# Altium schematic sheet F_Antenna.SchDoc: F-Antenna
size A4; Address3: Self Checking Shopping Cart; DocumentNumber: 1; Revision: 1.0; SheetNumber: 6; SheetTotal: 7
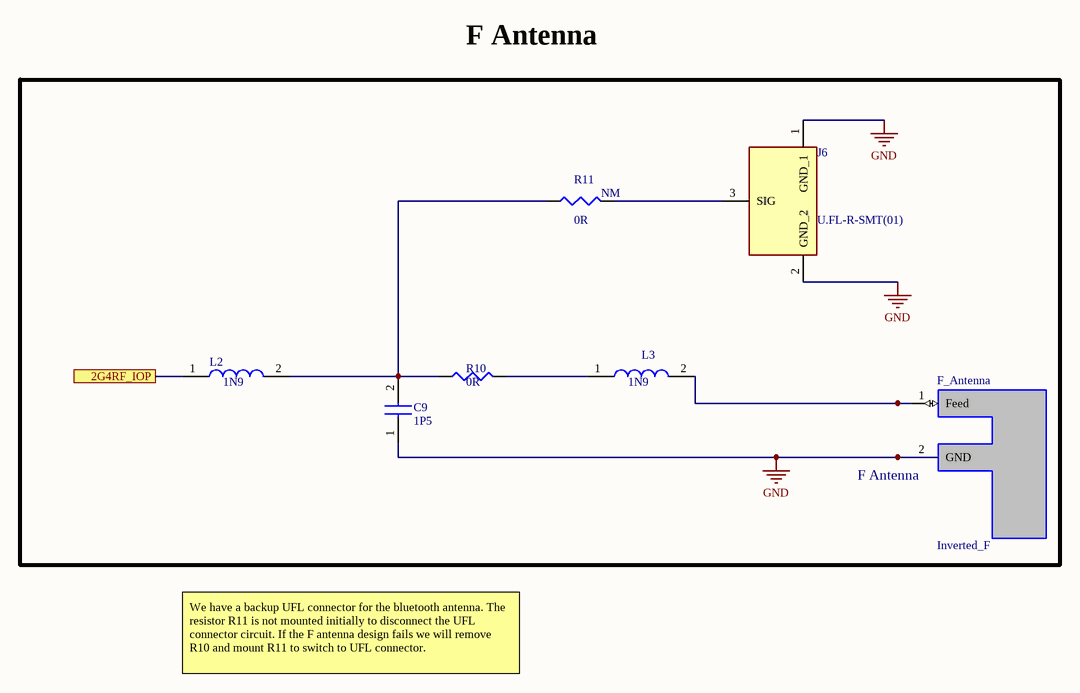
[diagram p0: F_Antenna.SchDoc]

## Parts
C9  value 1P5  [CAPC1005X55N]  (hidden comment: GRM1555C1H1R5WA01D)
F_Antenna  Inverted_F  [Inverted_F]
J6  U.FL-R-SMT(01)  [U.FL-R-SMT(01)]
L2  value 1N9  [INDC1005X45N]  (hidden comment: LQP15MN1N9W02D)
L3  value 1N9  [INDC1005X45N]  (hidden comment: LQP15MN1N9W02D)
R10  value 0R  [J1-0603]  (hidden comment: Res3)
R11  value 0R  Mounted: NM  [J1-0603]  (hidden comment: Res3)

## Blocks framed on the sheet
F Antenna: C9 F_Antenna J6 L2 L3 R10 R11

## Ports
2G4RF_IOP

## Nets
GND: C9.1 F_Antenna.2(GND) J6.1(GND_1) J6.2(GND_2)
2G4RF_IOP: L2.1 ; port 2G4RF_IOP
NetC9_2: C9.2 L2.2 R10.1 R11.1
NetF_Antenna_1: F_Antenna.1(Feed) L3.2
NetJ6_3: J6.3(SIG) R11.2
NetL3_1: L3.1 R10.2

## Notes on the sheet
- F Antenna
- We have a backup UFL connector for the bluetooth antenna. The resistor R11 is not mounted initially to disconnect the UFL connector circuit. If the F antenna design fails we will remove R10 and mount R11 to switch to UFL connector.
- Title
- Size:
- Date:
- A4
- Number:
- Time:
- Revision:
- Sheet
- of
- File:

## Library data of the parts
C9 = GRM1555C1H1R5WA01D: Capacitor; Manufacturer_Name: Murata Electronics; Datasheet Link: http://www.murata.com/~/media/webrenewal/support/library/catalog/products/capacitor/mlcc/c02e.pdf; Height: 0.55mm; Manufacturer_Part_Number: GRM1555C1H1R5WA01D; Mouser Part Number: 81-GRM1555C1H1R5WA1D; Mouser Price/Stock: https://www.mouser.com/Search/Refine.aspx?Keyword=81-GRM1555C1H1R5WA1D; RS Part Number: 8145441; RS Price/Stock: https://uk.rs-online.com/web/p/products/8145441
J6 = U.FL-R-SMT(01): Connector; Manufacturer_Name: Hirose; Datasheet Link: https://www.hirose.com/product/en/download_file/key_name/U.FL-R-SMT-1%2832%29/category/Drawing%20(2D)/doc_file_id/37630/?file_category_id=6&item_id=03310472232&is_series=; Manufacturer_Part_Number: U.FL-R-SMT(01); Mouser Part Number: 798-U.FL-R-SMT01; Mouser Price/Stock: https://www.mouser.com/Search/Refine.aspx?Keyword=798-U.FL-R-SMT01; RS Part Number: 4812324P; RS Price/Stock: http://uk.rs-online.com/web/p/products/4812324P
L2 L3 = LQP15MN1N9W02D: Inductor; Manufacturer_Name: Murata Electronics; Datasheet Link: https://psearch.en.murata.com/inductor/product/LQP15MN1N9W02%23.html; Height: 0.45mm; Manufacturer_Part_Number: LQP15MN1N9W02D; Mouser Part Number: 81-LQP15MN1N9W02D; Mouser Price/Stock: https://www.mouser.com/Search/Refine.aspx?Keyword=81-LQP15MN1N9W02D; RS Part Number: 7859073P; RS Price/Stock: http://uk.rs-online.com/web/p/products/7859073P
R10 R11 = Res3: Resistor; Manufacturer_Name: Vishay Dale; Manufacturer_Part_Number: CRCW06030000Z0EAHP; Detailed Description: 0 Ohms Jumper 0.25W, 1/4W Chip Resistor 0603 (1608 Metric) Automotive AEC-Q200, Pulse Withstanding Thick Film; Digi-Key Part Number: 541-0.0SBCT-ND; Digikey Price/Stock: https://www.digikey.com/product-detail/en/vishay-dale/CRCW06030000Z0EAHP/541-0.0SBCT-ND/2222749